# Altium schematic sheet M.2_NVME.SchDoc
size A3; SheetNumber: 2; SheetTotal: 10
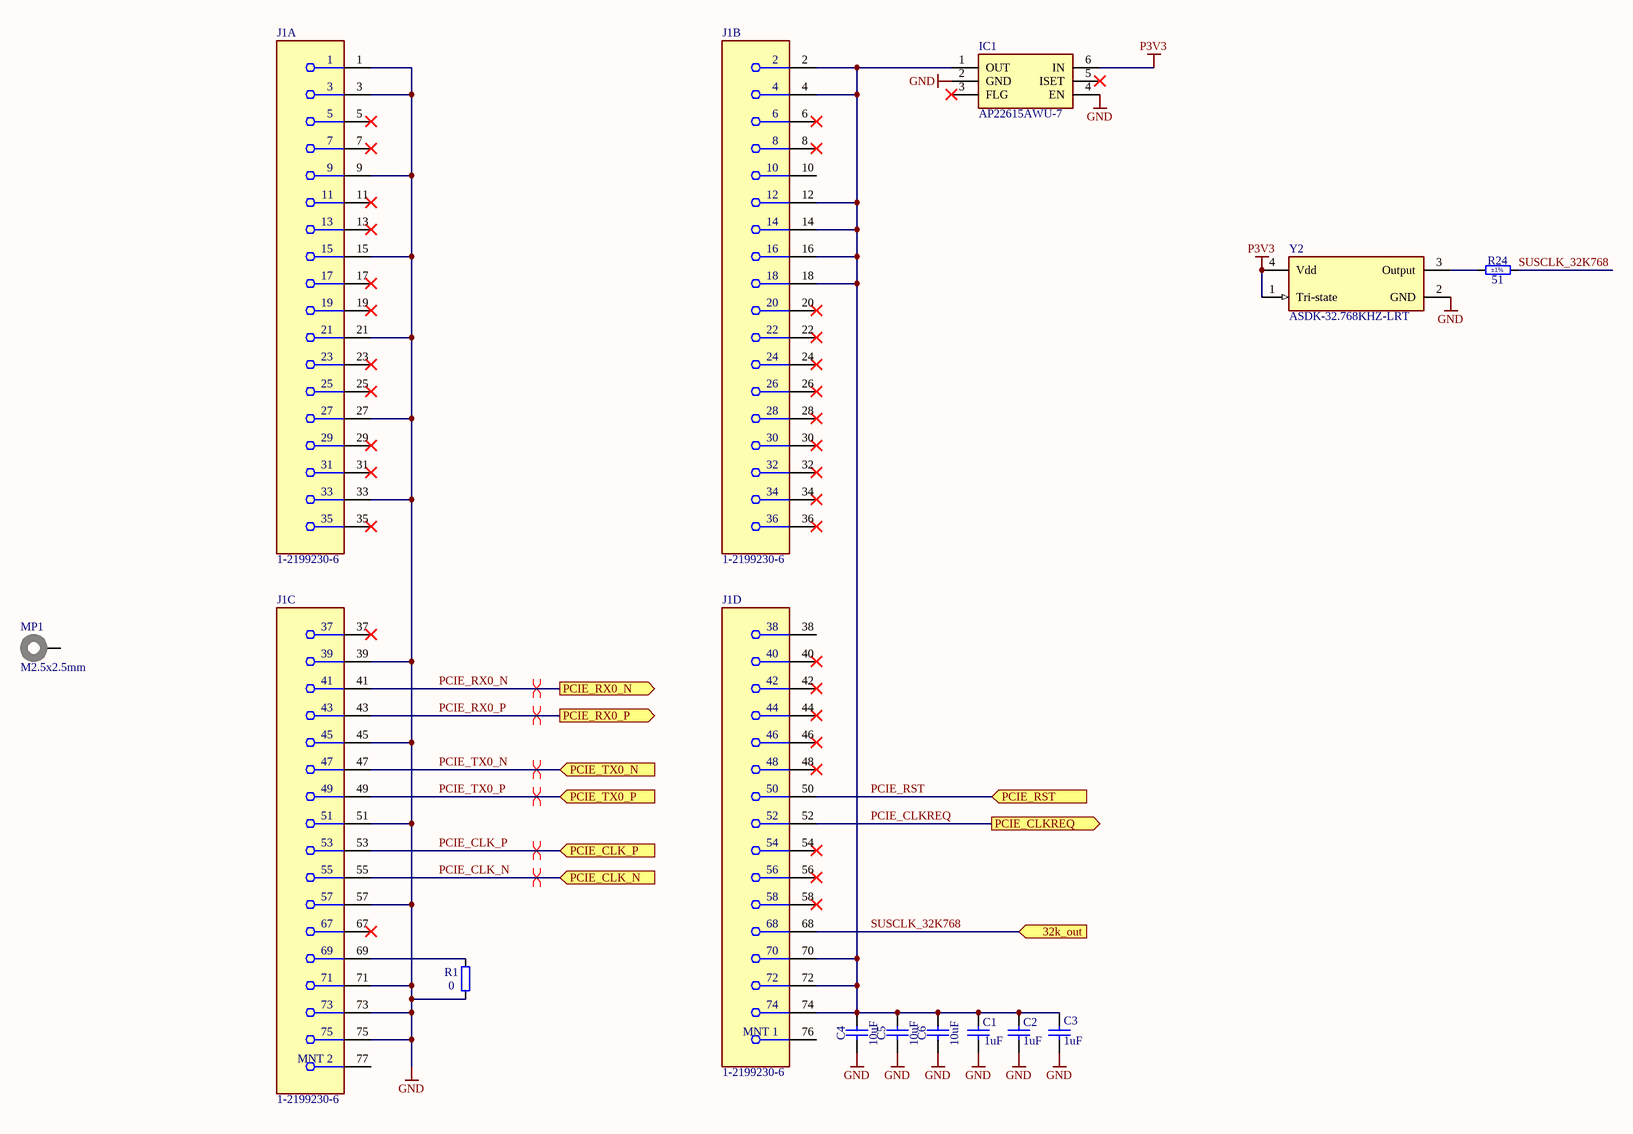
[diagram p0: M.2_NVME.SchDoc]

## Parts
C1  1uF  [CAPC1005X55N]
C2  1uF  [CAPC1005X55N]
C3  1uF  [CAPC1005X55N]
C4  10uF  [CAPC2012X95N]
C5  10uF  [CAPC2012X95N]
C6  10uF  [CAPC2012X95N]
IC1  AP22615AWU-7  [SOT95P280X100-6N]
J1  1-2199230-6  [FP-1-2199230-6-MFG]  (parts A,B,C,D of 4)
MP1  M2.5x2.5mm  [9774025151]
R1  0  [RESC1005X40N]
R24  51  Tolerance: ±1%  [RESC1005X40N]
Y2  ASDK-32.768KHZ-LRT  [FP-ASDK-MFG]

## Ports
32k_out (in), PCIE_CLK_N (in), PCIE_CLK_P (in), PCIE_CLKREQ (out), PCIE_RST (in), PCIE_RX0_N (out), PCIE_RX0_P (out), PCIE_TX0_N (in), PCIE_TX0_P (in)

## Nets
GND: C1.1 C2.1 C3.1 C4.1 C5.1 C6.1 IC1.2(GND) IC1.4(EN) J1.1 J1.3 J1.9 J1.15 J1.21 J1.27 J1.33 J1.39 J1.45 J1.51 J1.57 J1.71 J1.73 J1.75 R1.1 Y2.2(GND)
P3V3: IC1.6(IN) Y2.1(Tri-state) Y2.4(Vdd)
PCIE_CLK_N: J1.55 ; port PCIE_CLK_N
PCIE_CLK_P: J1.53 ; port PCIE_CLK_P
PCIE_CLKREQ: J1.52 ; port PCIE_CLKREQ
PCIE_RST: J1.50 ; port PCIE_RST
PCIE_RX0_N: J1.41 ; port PCIE_RX0_N
PCIE_RX0_P: J1.43 ; port PCIE_RX0_P
PCIE_TX0_N: J1.47 ; port PCIE_TX0_N
PCIE_TX0_P: J1.49 ; port PCIE_TX0_P
SUSCLK_32K768: J1.68 R24.2 ; port 32k_out
NetC1_2: C1.2 C2.2 C3.2 C4.2 C5.2 C6.2 IC1.1(OUT) J1.2 J1.4 J1.12 J1.14 J1.16 J1.18 J1.70 J1.72 J1.74
NetJ1_69: J1.69 R1.2
NetR24_1: R24.1 Y2.3(Output)

Not connected (* = marked no-connect by the designer): IC1 3(FLG)* 5(ISET)*; J1 5* 6* 7* 8* 10 11* 13* 17* 19* 20* 22* 23* 24* 25* 26* 28* 29* 30* 31* 32* 34* 35* 36* 37* 38 40* 42* 44* 46* 48* 54* 56* 58* 67* 76(MNT_1) 77(MNT_2); MP1 1

## Layout directives
differential pair: PCIE_CLK_N, PCIE_CLK_P, PCIE_RX0_N, PCIE_RX0_P, PCIE_TX0_N, PCIE_TX0_P

## Library data of the parts
C1-C3 = CC0402_1UF_16V_10%_X5R: Non-polarised capacitor; Part Description: SMD Multilayer Chip Ceramic Capacitor; Manufacturer: GENERIC; Manufacturer1 Part Number: C1005X5R1C105KT; Voltage: 16V; TC: X5R; Tolerance: ±10%; Part Number: CC0402_1UF_16V_10%_X5R; Component Kind: Standard; Component Type: Standard; Pin Count: 2; Value: 1uF; Status: Preferred; Manufacturer Part Number: CC0402_1UF_16V_10%_X5R; Case: 0402; Mounted: Yes; Socket: No; SMD: Yes; Sense: No; Manufacturer1 Example: TDK; Manufacturer1 ComponentHeight: 0.55mm; HelpURL: \\cern.ch\dfs\Applications\Altium\Datasheets\CC0402_X5R_TDK_C.pdf; Author: CERN DEM JLC; CreateDate: 2012-10-25; LatestRevisionDate: 2012-10-25
C4-C6 = CC0805_10UF_25V_10%_X5R: Non-polarised capacitor; Part Description: SMD Multilayer Chip Ceramic Capacitor; Manufacturer: GENERIC; Manufacturer1 Part Number: GRM219R61E106KA12D; Voltage: 25V; TC: X5R; Tolerance: ±10%; Part Number: CC0805_10UF_25V_10%_X5R; Component Kind: Standard; Component Type: Standard; Pin Count: 2; Value: 10uF; Status: Preferred; Manufacturer Part Number: CC0805_10UF_25V_10%_X5R; Case: 0805; Mounted: Yes; Socket: No; SMD: Yes; Sense: No; Manufacturer1 Example: MURATA; Manufacturer1 ComponentHeight: 0.95mm; HelpURL: \\cern.ch\dfs\Applications\Altium\Datasheets\CC0805_X5R_MURATA_GRM.pdf; Author: CERN DEM JLC; CreateDate: 25.10.2012; LatestRevisionDate: 06.09.2016
IC1 = AP22615AWU-7: Integrated Circuit; Manufacturer_Name: Diodes Inc.; Datasheet Link: https://www.diodes.com/assets/Datasheets/AP22815-615.pdf; Height: 1mm; Manufacturer_Part_Number: AP22615AWU-7
J1 = CMP-03365-000001-1: CONN EDGE DUAL FMALE 67POS 0.020; Manufacturer: TE; Number Of Contacts: 67; Current Rating: 0.5A; Pitch: 0.5mm; Conn Gender: Female; Is Female: yes; Voltage Rating: 50V; Conn Orientation: Right Angle; Automotive: No; Temperature Range High: +80°C; Package: 1-2199230-6; Category: Conn; Temperature: -40°C to +80°C; Number Of Rows: 2; ComponentLink2URL: http://www.te.com/commerce/DocumentDelivery/DDEController?Action=showdoc&DocId=Specification+Or+Standard%7F114-115006%7FB%7Fpdf%7FEnglish%7FENG_SS_114-115006_B_114-115006_REV_B.pdf%7F1-2199230-6; Manufacturer Part Number: 1-2199230-6; Height: 4.2mm; RoHS: TRUE; Footprint Url: http://www.te.com/commerce/DocumentDelivery/DDEController?Action=showdoc&DocId=Customer+Drawing%7F2199230%7FB2%7Fpdf%7FEnglish%7FENG_CD_2199230_B2.pdf%7F1-2199230-6; Digikey Description: CONN EDGE DUAL FMALE 67POS 0.020; Device Class L2: Card Edge Connectors; Contact Material: Gold,Tin; Device Class L1: Connectors; Device Class L3: unset; ComponentLink2Description: Datasheet; Temperature Range Low: -40°C; Octopart: https://octopart.com/1-2199230-6-te+connectivity-34969376; Lead Free: Yes
MP1 = 9774025151: WA-SMSI SMT Steel Spacer, internal Thread, OD 5.1mm, M2.5x2.5mm; Manufacturer: Wurth Elektronik; Inner Diameter: 3.5mm; Surface: Tin; Thread: M2.5; ComponentLink1Description: Manufacturer; ComponentLink1URL: http://www.we-online.de; ComponentLink2Description: Datasheet; ComponentLink2URL: https://www.we-online.com/catalog/datasheet/9774025151.pdf; Mounting Technology: SMT; Packaging: Bulk; Manufacturer Part Number: 9774025151; Length: 2.5mm; Inner Thread Length: -; Operating Temperature: -55 to +150degC; Outer Diameter: 5.1mm; Published Date: April 2020; Material: Steel
R1 = R0402_0R_JUMPER: Resistor; Part Description: 1A (0.05R Max DC Resistance) Zero Ohm Jumper; Manufacturer: GENERIC; Manufacturer1 Part Number: 232270591001L; PressFit: No; Part Number: R0402_0R_JUMPER; Component Kind: Standard; Component Type: Standard; Pin Count: 2; Value: 0; Status: Not Recommended; Manufacturer Part Number: R0402_0R_JUMPER; Case: 0402; Mounted: Yes; Sense: No; Socket: No; SMD: Yes; Manufacturer1 Example: YAGEO PHYCOMP; Manufacturer1 ComponentHeight: 0.4mm; HelpURL: \\cern.ch\dfs\Applications\Altium\Datasheets\R0402_Phycomp_RC0402.pdf; Author: CERN DEM JLC; CreateDate: 03.12.2007; LatestRevisionDate: 17.10.2012
R24 = R0402_51R_1%_0.0625W_100PPM: Resistor - 1%; Part Description: General Purpose Thick Film Chip Resistor; Manufacturer: GENERIC; Manufacturer1 Part Number: 232270675109L; TC: ±100ppm/°C; PressFit: No; Part Number: R0402_51R_1%_0.0625W_100PPM; Component Kind: Standard; Component Type: Standard; Pin Count: 2; Value: 51; Status: Not Recommended; Power: 0.0625W; Manufacturer Part Number: R0402_51R_1%_0.0625W_100PPM; Case: 0402; Mounted: Yes; Sense: No; Socket: No; SMD: Yes; Manufacturer1 Example: YAGEO PHYCOMP; Manufacturer1 ComponentHeight: 0.4mm; HelpURL: \\cern.ch\dfs\Applications\Altium\Datasheets\R0402_Phycomp_RC0402.pdf; Author: CERN DEM JLC; CreateDate: 03.12.2007; LatestRevisionDate: 17.10.2012
Y2 = CMP-27762-001115-1: XTAL OSC XO 32.7680KHZ CMOS SMD; Load Capacitance: 15pF; Max Supply Current: 3.5mA; Min Supply Voltage: 2.97V; Operating Supply Voltage: 3.3V; Frequency Stability: 25ppm; Lead Free: Lead Free; Case/Package: CSMD; Number of Pins: 4; Max Operating Temperature: 85°C; Packaging: Tape and Reel; Width: 0.079inch; Min Operating Temperature: -40°C; Radiation Hardening: No; Length: 2.5mm; Depth: 2mm; Termination: SMD/SMT; Height: 0.037inch; Series: ASDK; Frequency: 32.768kHz; Mount: Surface Mount